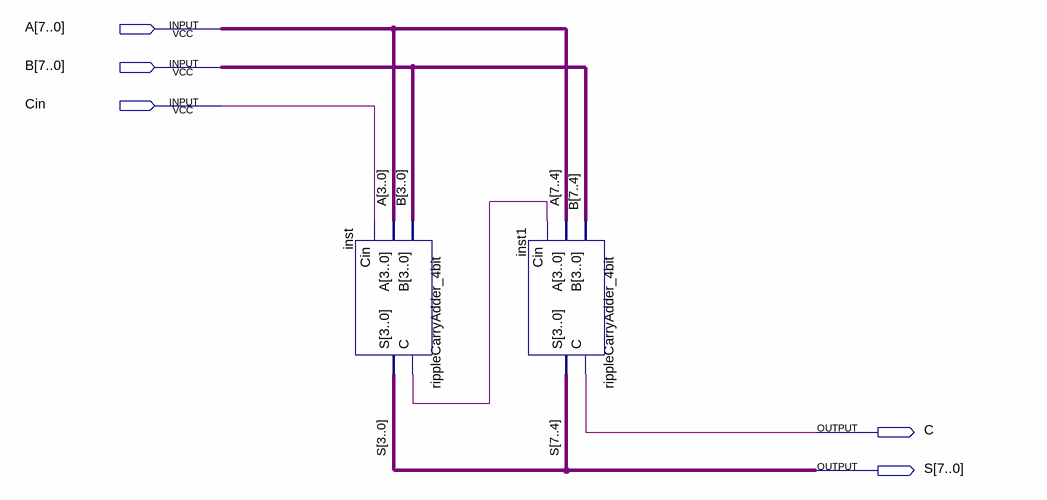
[diagram p0: schematic sheet]
// Quartus schematic RippleCarryAdder_8Bit.bdf as structural Verilog: 2 symbols, 5 pins
module RippleCarryAdder_8Bit (
  input  [7:0] A,
  input  [7:0] B,
  input  Cin,
  output C,
  output [7:0] S
);

  wire inst_c;

  rippleCarryAdder_4bit inst (.B(B[3:0]), .A(A[3:0]), .Cin(Cin), .C(inst_c), .S(S[3:0]));
  rippleCarryAdder_4bit inst1 (.B(B[7:4]), .A(A[7:4]), .Cin(inst_c), .C(C), .S(S[7:4]));
endmodule
